# EAGLE design extracticon v2 (EAGLE 5.12)
DATABASE: ../partsdb.txt; PARTNO: LM335Z/NOPB
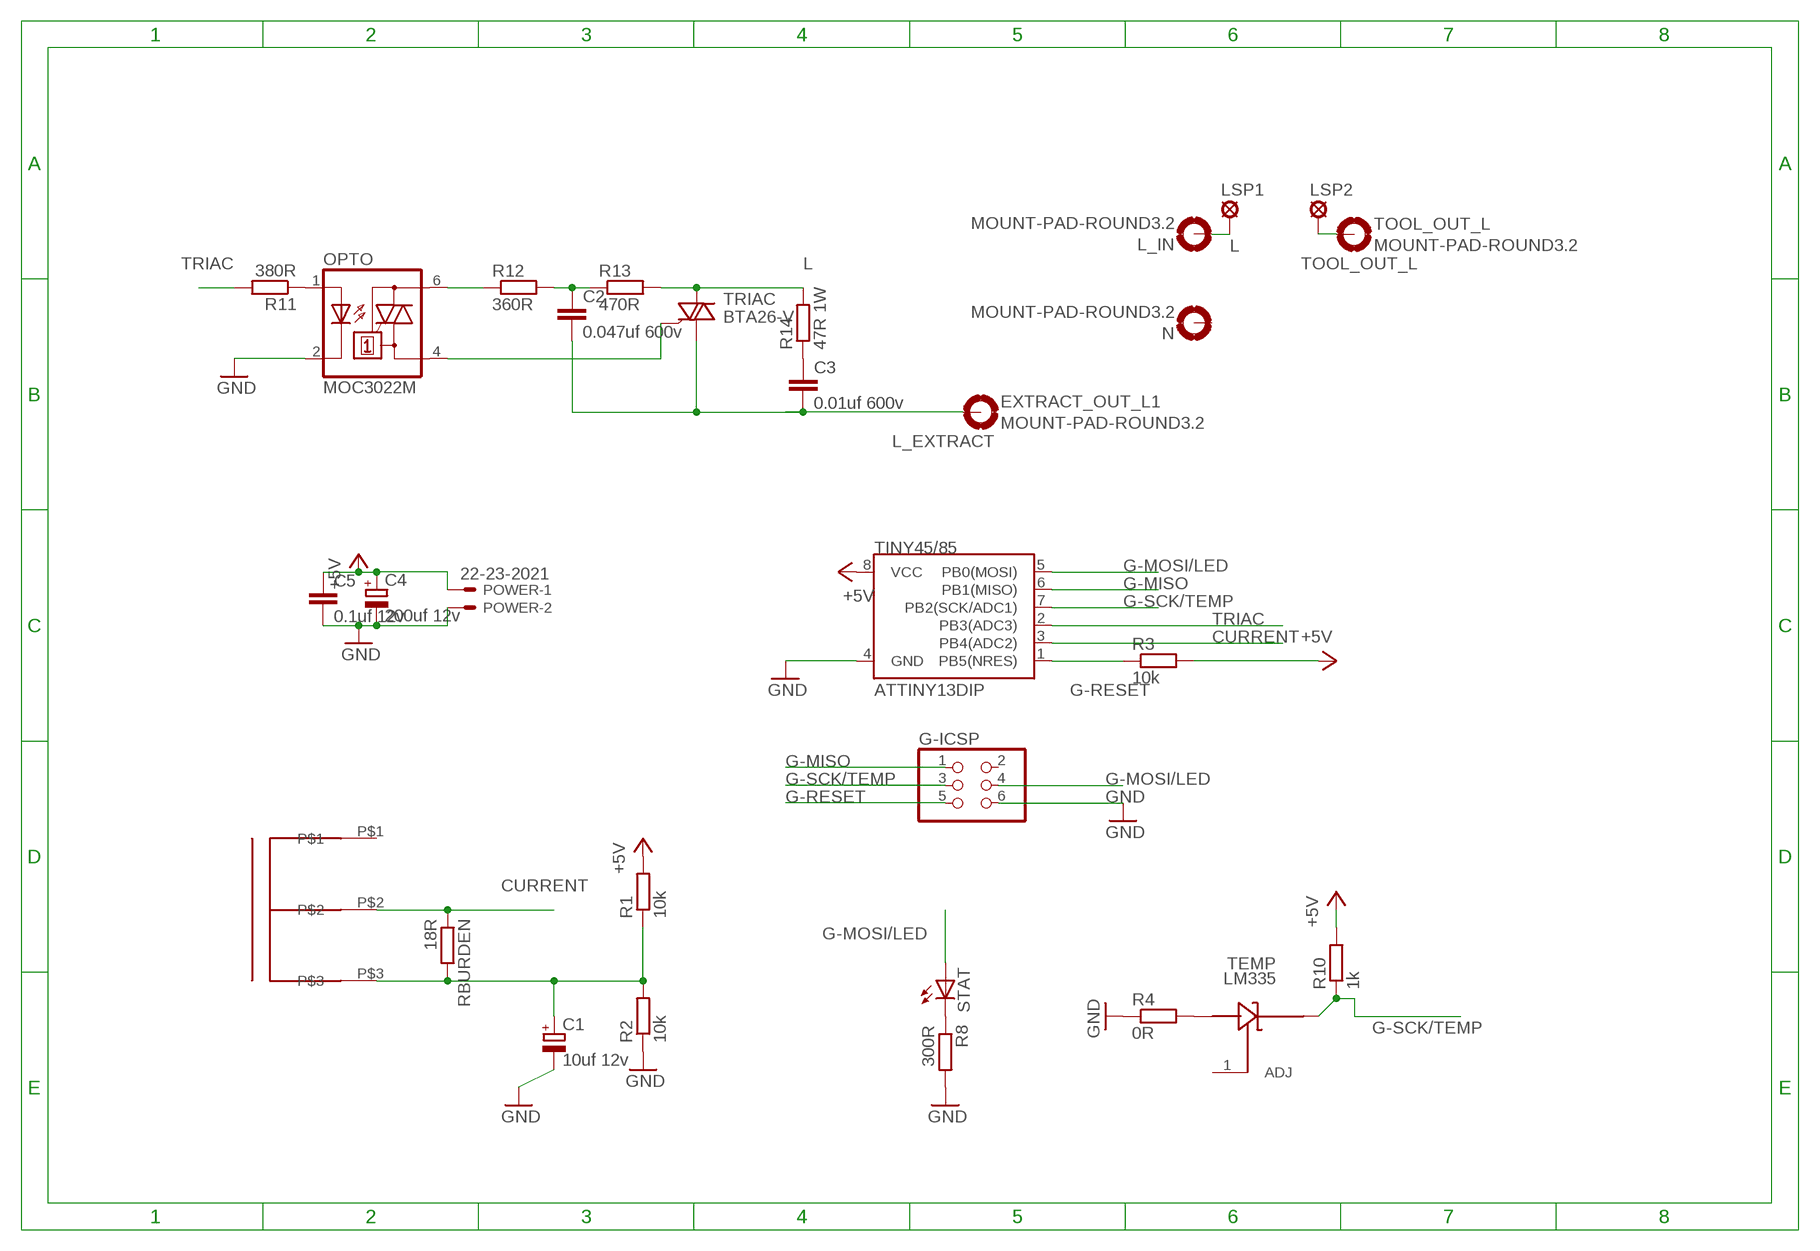
[diagram p0: schematic, sheet 1]

## Parts
C1  10uf 12v  CPOL-EUE2.5-5  [E2,5-5]
C2  0.047uf 600v  C-EU075-052X106  [C075-052X106]
C3  0.01uf 600v  C-EU050-050X075  [C050-050X075]
C4  200uf 12v  CPOL-EUE2.5-5  [E2,5-5]
C5  0.1uf 12v  C-EU050-025X075  [C050-025X075]
CT  CT  [CT]
EXTRACT_OUT_L1  MOUNT-PAD-ROUND3.2  [3,2-PAD]
G-ICSP  PINHD-2X3  [2X03]
L_IN  MOUNT-PAD-ROUND3.2  [3,2-PAD]
LSP1  SE14  [SE14]
LSP2  SE14  [SE14]
N  MOUNT-PAD-ROUND3.2  [3,2-PAD]
OPTO  MOC3022M  [DIL06]
POWER  22-23-2021  [22-23-2021]
R1  10k  R-EU_0204/7  [0204/7]
R2  10k  R-EU_0204/7  [0204/7]
R3  10k  R-EU_0204/7  [0204/7]
R4  0R  R-EU_0204/7  [0204/7]
R8  300R  R-EU_0204/7  [0204/7]
R10  1k  R-EU_0204/7  [0204/7]
R11  380R  R-EU_0204/7  [0204/7]
R12  360R  R-EU_0204/7  [0204/7]
R13  470R  R-EU_0204/7  [0204/7]
R14  47R 1W  R-EU_0411/12  [0411/12]
RBURDEN  18R  R-EU_0204/7  [0204/7]
STAT  LED5MM  [LED5MM]
TEMP  LM335  [TO92]
TINY45/85  ATTINY13DIP  [DIP08]
TOOL_OUT_L  MOUNT-PAD-ROUND3.2  [3,2-PAD]
TRIAC  BTA26-V  [TOP3S-1]

## Nets
+5V: C4.+ C5.1 POWER.1 R1.2 R3.2 R10.2 TINY45/85.8(VCC)
CURRENT: CT.P$2 RBURDEN.1 TINY45/85.3(PB4(ADC2))
G-MISO: G-ICSP.1 TINY45/85.6(PB1(MISO))
G-MOSI/LED: G-ICSP.4 STAT.A TINY45/85.5(PB0(MOSI))
G-RESET: G-ICSP.5 R3.1 TINY45/85.1(PB5(NRES))
G-SCK/TEMP: G-ICSP.3 R10.1 TEMP.2(IN) TINY45/85.7(PB2(SCK/ADC1))
GND: C1.- C4.- C5.2 G-ICSP.6 OPTO.2(C) POWER.2 R2.1 R4.1 R8.2 TINY45/85.4(GND)
L [power]: L_IN.B3,2(MOUNT) LSP1.MP R13.2 R14.2 TRIAC.A2
L_EXTRACT [power]: C2.2 C3.2 EXTRACT_OUT_L1.B3,2(MOUNT) TRIAC.A1
N$1: OPTO.6(A2) R12.1
N$2: C1.+ CT.P$3 R1.1 R2.2 RBURDEN.2
N$8: C2.1 R12.2 R13.1
N$11: OPTO.1(A) R11.1
N$12 [power]: C3.1 R14.1
N$13: R8.1 STAT.K(C)
OUT: R4.2 TEMP.3(OUT)
TOOL_OUT_L: LSP2.MP TOOL_OUT_L.B3,2(MOUNT)
TRI_GATE: OPTO.4(A1) TRIAC.G
TRIAC: R11.2 TINY45/85.2(PB3(ADC3))
Unconnected: CT.P$1 G-ICSP.2 N.B3,2(MOUNT) TEMP.1(ADJ)

## Library data of the parts
C1 C4 = rcl:CPOL-EU: POLARIZED CAPACITOR, European symbol
C2 C3 C5 = matt rcl:C-EU: CAPACITOR, European symbol
CT = matt:CT
EXTRACT_OUT_L1 L_IN N TOOL_OUT_L = holes:MOUNT-PAD-ROUND: MOUNTING PAD, round
G-ICSP = pinhead:PINHD-2X3: PIN HEADER
LSP1 LSP2 = solpad:SE14: SOLDER PAD E1553, drill 1,4mm, distributor Buerklin, 07F820
OPTO = optocoupler:MOC30*M: RANDOM-PHASE OPTOISOLATORS TRIAC DRIVER OUTPUT Source: http://www.fairchildsemi.com MOC3020-M.pdf; MF: FAIRCHILD SEMICONDUCTOR; MPN: MOC3022-M; OC_FARNELL: 1021086; OC_NEWARK: 58K1956
POWER = con-molex:22-23-2021: .100" (2.54mm) Center Header - 2 Pin; MF: MOLEX; MPN: 22-23-2021; OC_FARNELL: 1462926; OC_NEWARK: 25C3832
R1-R4 R8 R10-R14 RBURDEN = matt rcl:R-EU_: RESISTOR, European symbol
STAT = matt led:LED: LED OSRAM: - CHIPLED LG R971, LG N971, LY N971, LG Q971, LY Q971, LO R971, LY R971 LH N974, LH R974 LS Q976, LO Q976, LY Q976 LO Q996 - Hyper CHIPLED LW Q18S LB Q993, LB Q99A, LB R99A - SideLED LS A670, LO A670, LY A670, LG A670, LP A670 LB A673, LV A673, LT A673, LW A673 LH A674 LY A675 LS A676, LA A676, LO A676, LY A676, LW A676 LS A679, LY A679, LG A679 - Hyper Micro SIDELED® LS Y876, LA Y876, LO Y876, LY Y876 LT Y87S - SmartLED LW L88C, LW L88S LB L89C, LB L89S, LG L890 LS L89K, LO L89K, LY L89K LS L896, LA L896, LO L896, LY L896 - TOPLED LS T670, LO T670, LY T670, LG T670, LP T670 LSG T670, LSP T670, LSY T670, LOP T670, LYG T670 LG T671, LOG T671, LSG T671 LB T673, LV T673, LT T673, LW T673 LH T674 LS T676, LA T676, LO T676, LY T676, LB T676, LH T676, LSB T676, LW T676 LB T67C, LV T67C, LT T67C, LS T67K, LO T67K, LY T67K, LW E67C LS E67B, LA E67B, LO E67B, LY E67B, LB E67C, LV E67C, LT E67C LW T67C LS T679, LY T679, LG T679 LS T770, LO T770, LY T770, LG T770, LP T770 LB T773, LV T773, LT T773, LW T773 LH T774 LS E675, LA E675, LY E675, LS T675 LS T776, LA T776, LO T776, LY T776, LB T776 LHGB T686 LT T68C, LB T68C - Hyper Mini TOPLED® LB M676 - Mini TOPLED Santana® LG M470 LS M47K, LO M47K, LY M47K Source: http://www.osram.convergy.de LUXEON: - LUMILED® LXK2-PW12-R00, LXK2-PW12-S00, LXK2-PW14-U00, LXK2-PW14-V00 LXK2-PM12-R00, LXK2-PM12-S00, LXK2-PM14-U00 LXK2-PE12-Q00, LXK2-PE12-R00, LXK2-PE12-S00, LXK2-PE14-T00, LXK2-PE14-U00 LXK2-PB12-K00, LXK2-PB12-L00, LXK2-PB12-M00, LXK2-PB14-N00, LXK2-PB14-P00, LXK2-PB14-Q00 LXK2-PR12-L00, LXK2-PR12-M00, LXK2-PR14-Q00, LXK2-PR14-R00 LXK2-PD12-Q00, LXK2-PD12-R00, LXK2-PD12-S00 LXK2-PH12-R00, LXK2-PH12-S00 LXK2-PL12-P00, LXK2-PL12-Q00, LXK2-PL12-R00 Source: www.luxeon.com KINGBRIGHT: KA-3528ASYC Source: www.kingbright.com
TEMP = matt:LM335
TINY45/85 = SparkFun:ATTINY13
TRIAC = triac:BTA26: 25A TRIAC Source: http://www.st.com/stonline/products/literature/ds/7470.pdf

## Net classes
0 default: width 0.406 mm
1 power: width 2.54 mm, clearance 2 mm

## Board
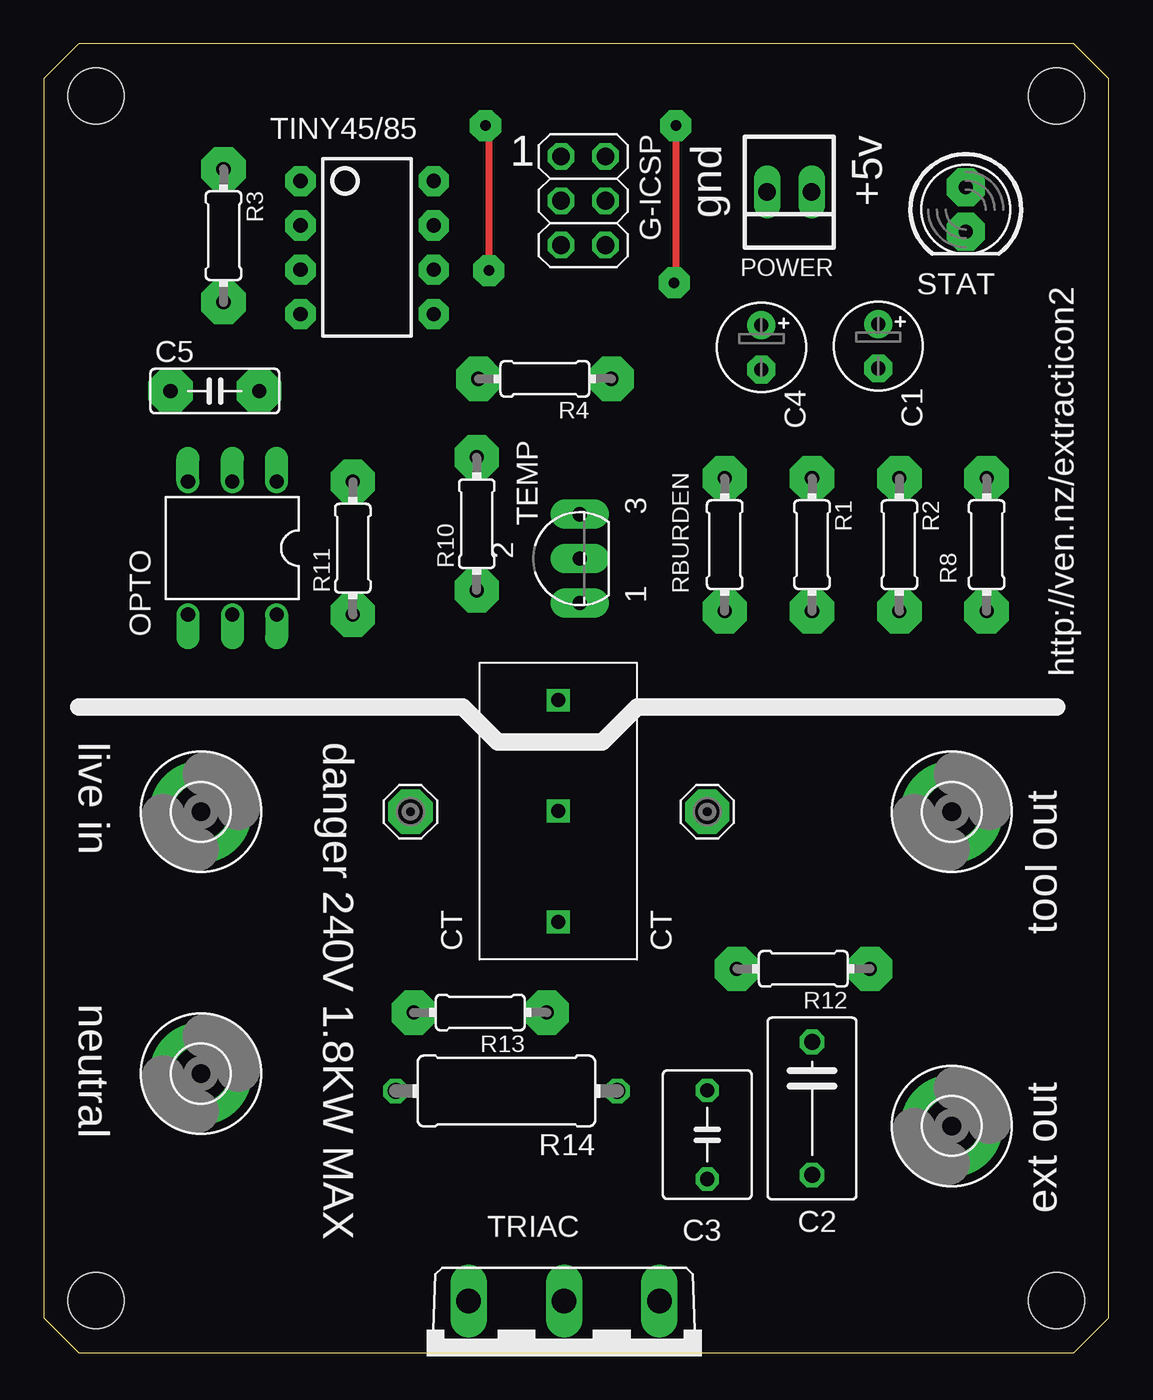
[diagram p1: board, top side]
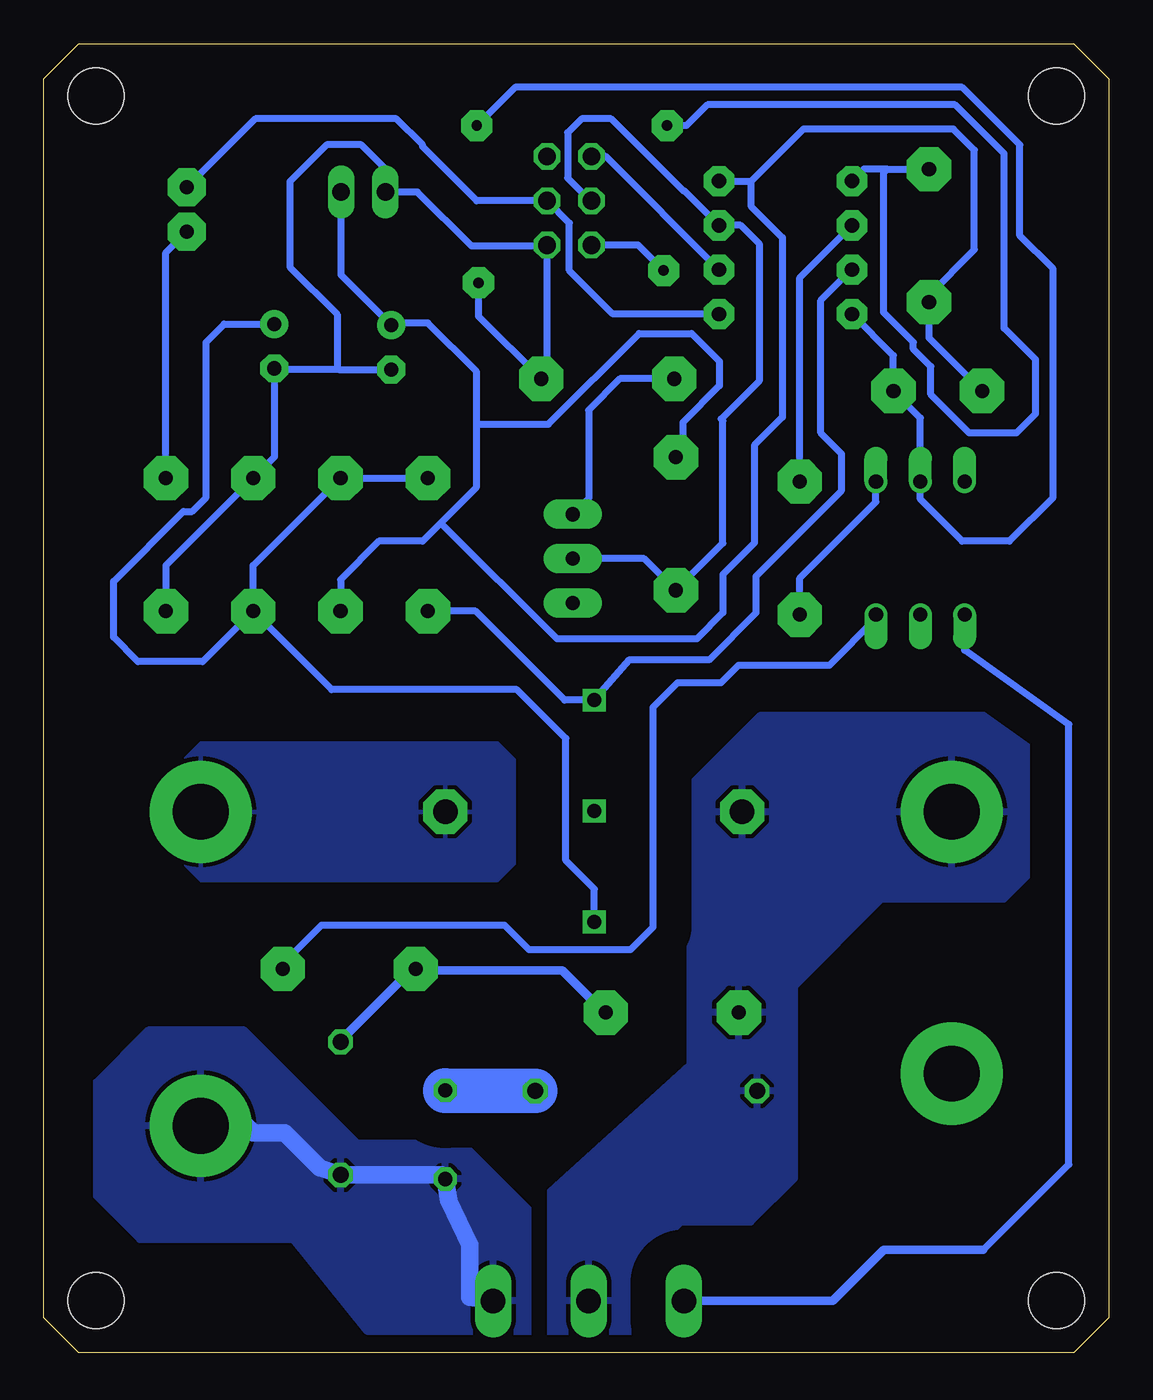
[diagram p2: board, bottom side, seen from below]

Size 61 x 75 mm. Coordinates in mm from the lower left corner, seen from the top.
Outline: 61,73 59,75 2,75 0,73 0,2 2,0 59,0 61,2 61,73
Copper layers (1*16): Top 0.035mm / dielectric 1.5mm / Bottom 0.035mm
Design rules "default": minimum track width 10mil, minimum drill 24mil, track to track 8mil, track to pad 8mil, pad to pad 8mil, via to via 8mil, smd to smd 8mil, copper to edge 40mil, drill to drill 8mil, minimum pad ring 10mil, minimum via ring 8mil, stop-mask expansion 4mil, vias tented up to drill 0mil, thermal gap 10mil
Holes 3.2 mm at 3,3 58,3 3,72 58,72

### Footprints (pad centres in the part's own frame; a part is rotated, then mirrored left to right if it is on the bottom)
E2,5-5 = drill 0.813 pad 1.6 round: + -1.27,0 | drill 0.813 pad 1.6 octagon: - 1.27,0
C075-052X106 = drill 0.914 octagon: 1 -3.81,0; 2 3.81,0
C050-050X075 = drill 0.813 octagon: 1 -2.54,0; 2 2.54,0
C050-025X075 = drill 0.813 pad 2.54 octagon: 1 -2.54,0; 2 2.54,0
CT = drill 0.8 square: P$1 0,0; P$2 6.35,0; P$3 -6.35,0
3,2-PAD = drill 3.2 pad 5.842 round: B3,2 0,0
2X03 = drill 1.016 octagon: 1 -2.54,-1.27; 2 -2.54,1.27; 3 0,-1.27; 4 0,1.27; 5 2.54,-1.27; 6 2.54,1.27
SE14 = drill 1.397 pad 2.54 octagon: MP 0,0
DIL06 = drill 0.813 offset: 1 -2.54,-3.81; 2 0,-3.81; 3 2.54,-3.81; 4 2.54,3.81; 5 0,3.81; 6 -2.54,3.81
22-23-2021 = drill 1 long: 1 -1.27,0; 2 1.27,0
0204/7 = drill 0.813 pad 2.54 octagon: 1 -3.81,0; 2 3.81,0
0411/12 = drill 0.914 octagon: 1 -6.35,0; 2 6.35,0
LED5MM = drill 0.813 pad 2.184 octagon: A -1.27,0; K 1.27,0
TO92 = drill 0.813 pad 1.676 long: 1 -2.54,0; 2 0,0; 3 2.54,0
DIP08 = drill 0.813 pad 1.727 octagon: 1 -3.81,-3.81; 2 -1.27,-3.81; 3 1.27,-3.81; 4 3.81,-3.81; 5 3.81,3.81; 6 1.27,3.81; 7 -1.27,3.81; 8 -3.81,3.81
TOP3S-1 = drill 1.397 long: A1 -5.461,-3.175; A2 0,-3.175; G 5.461,-3.175

### Placement (x,y rotation side)
C1  47.79,57.67 270 top
C2  44,14 270 top
C3  38,12.5 270 top
C4  41.1,57.6 270 top
C5  9.8,55.1 0 top
CT  29.47,31.04 90 top
EXTRACT_OUT_L1  52,13 0 top
G-ICSP  30.9,66 270 top
L_IN  9,31 0 top
LSP1  21,31 0 top
LSP2  38,31 0 top
N  9,16 0 top
OPTO  10.8,46.1 180 top
POWER  42.7,66.5 180 top
R1  44,46.3 270 top
R2  49,46.3 270 top
R3  10.3,64 270 top
R4  28.7,55.8 180 top
R8  54,46.3 270 top
R10  24.8,47.5 90 top
R11  17.7,46.1 90 top
R12  43.5,22 180 top
R13  25,19.5 180 top
R14  26.5,15 180 top
RBURDEN  39,46.3 90 top
STAT  52.8,65.5 270 top
TEMP  30.7,45.5 90 top
TINY45/85  18.52,63.32 270 top
TOOL_OUT_L  52,31 0 top
TRIAC  29.8,-0.2 180 top

### Tracks (layer width: path | path; a pad name or v marks a point on that pad's centre or on a via)
+5V
  Bottom 0.406: R1.2 44,44.3 41.8,46.5 39.3,46.5 38.25,47.55 | 38.25,47.55 36.2,49.6 36.2,53.1 | 36.2,53.1 36.2,56.2 39,59 40.97,59 C4.+ 43.97,61.74 POWER.1 | 36.2,53.1 36.1,53.2 32.1,53.2 26.9,58.4 23.9,58.4 22.3,56.8 22.3,55.4 24.4,53.3 24.4,51.71 R10.2 | C5.1 10.3,58.14 R3.2 10.3,60.6 7.7,63.2 7.7,68.9 8.9,70.1 17.5,70.1 20.5,67.1 | 20.5,67.1 22.3,67.1 TINY45/85.8 | 20.5,67.1 20.5,65.7 18.7,63.9 18.7,53.6 20.3,52 20.3,46.4 22.1,44.6 22.1,42.4 23.6,40.9 31.6,40.9 38.25,47.55
CURRENT
  Bottom 0.406: RBURDEN.1 36.27,42.49 31.17,37.39 CT.P$2 27.46,39.7 22.9,39.7 20.2,42.4 20.2,44.5 15.3,49.4 15.3,51.5 16.5,52.7 16.5,60.3 14.75,62.05 TINY45/85.3
G-MISO
  Bottom 0.406: G-ICSP.1 28.82,68.54 TINY45/85.6
G-MOSI/LED
  Bottom 0.406: TINY45/85.5 28.41,59.51 30.9,62 30.9,64.73 G-ICSP.4 36.2,66 39.3,69.1 39.3,69.2 40.8,70.7 48.87,70.7 STAT.A
G-RESET  (via drill 0.6 pad 1.78)
  Top 0.406: v25.5,62 25.5,70.1 v25.3,70.3
  Bottom 0.406: G-ICSP.5 26.96,63.46 v25.5,62 | 12.7,67.81 R3.1 | 12.7,67.81 14.03,67.81 TINY45/85.1 | v25.3,70.3 24.2,70.3 23,71.5 8.8,71.5 6,68.7 6,58.7 4.2,56.9 4.2,53.8 5.3,52.7 8,52.7 10.2,54.9 10.2,56.5 11.2,57.5 11.2,57.9 12.9,59.6 12.9,67.61 12.7,67.81
G-SCK/TEMP
  Bottom 0.406: G-ICSP.3 29.7,66 31,67.3 31,69.9 30.2,70.7 28.5,70.7 24.36,66.56 24.3,66.56 TINY45/85.7 21.09,64.59 20,63.5 20,55.7 22.2,53.5 22.1,53.4 22.1,46.39 R10.1 26.61,45.5 TEMP.2
GND  (via drill 0.6 pad 1.78)
  Top 0.406: v36.2,70.3 36.2,61.4 v36.1,61.3
  Bottom 0.406: R8.2 54,45.11 R2.1 47.79,51.32 C1.- 47.72,56.33 44.1,56.33 | 44.1,56.33 C4.- | TINY45/85.4 12.34,57.14 C5.2 10.8,53.56 OPTO.2 10.8,48.9 8.4,46.5 5.7,46.5 3.2,49 3.2,62.1 5.1,64 5.1,69.2 8.4,72.5 34,72.5 v36.2,70.3 | 44.1,56.33 44.2,56.43 44.2,59.5 46.9,62.2 46.9,67.1 44.8,69.2 42.8,69.2 41.43,67.83 POWER.2 39.6,66.5 36.5,63.4 32.23,63.4 G-ICSP.6 32.17,56.14 R4.1 36.1,59.39 v36.1,61.3
L
  pour Bottom: 6,36.5 20,36.5 24,32.5 24,16.5 32,9.25 32,1 27.5,1 27.5,4.5 24.5,7.5 20.5,7.5 18,10 18,21 13,26 6,26 4,28 4,34.5
L_EXTRACT
  Bottom 1.016: C2.2 38.2,10.2 38,10 C3.2 37.8,8.7 36.6,6.2 36.6,3.2 TRIAC.A1 | C2.2 | EXTRACT_OUT_L1.B3,2 49.4,13 49,12.6 47.2,12.6 45.2,10.6 C2.2
  pour Bottom: 33.25,1 33.25,8.25 37,12 43,12 49.5,18.5 55,18.5 58,15.5 58,9 55.5,6.5 46.75,6.5 42.5,1.25
N$1
  Bottom 0.406: R12.1 47.31,22.29 45.1,24.5 34.6,24.5 33.2,23.1 27.4,23.1 26.1,24.4 26.1,37 24.7,38.4 22.2,38.4 21.2,39.4 16,39.4 13.34,42.06 OPTO.6
N$2
  Bottom 0.406: R2.2 49,45.11 R1.1 RBURDEN.2 | C1.+ 50.66,58.94 51.7,57.9 51.7,49 52.5,48.2 53,48.2 57,44.2 57,41 55.6,39.6 51.89,39.6 R2.2 | CT.P$3 29.47,26.57 31.1,28.2 31.1,35.2 33.9,38 44.51,38 R2.2
N$8
  Bottom 0.5: C2.1 44,17.9 39.9,22 R12.2 39.5,21.9 31.3,21.9 28.9,19.5 R13.1
N$11
  Bottom 0.406: OPTO.1 13.34,48.75 17.7,44.39 R11.1
N$12
  Bottom 2.54: C3.1 38,15 R14.1
N$13
  Bottom 0.406: R8.1 54,63.03 STAT.K
OUT
  Bottom 0.406: R4.2 28,55.8 29.8,54 29.8,48.94 TEMP.3
TOOL_OUT_L
  pour Bottom (isolate 0.813): 35,35 52,35 54,33 54,29 52,27 35,27 34,28 34,34
TRI_GATE
  Bottom 0.406: OPTO.4 8.26,40.26 2.3,36 2.3,10.8 7.2,5.9
  Bottom 0.5: 7.2,5.9 12.9,5.9 15.8,3 24.3,3 TRIAC.G
TRIAC
  Bottom 0.406: R11.2 17.7,61.6 TINY45/85.2

### Text on the board
tNames: 1 | +5v | gnd | http://ven.nz/extracticon2 | live in | danger 240V 1.8KW MAX | tool out | neutral | ext out